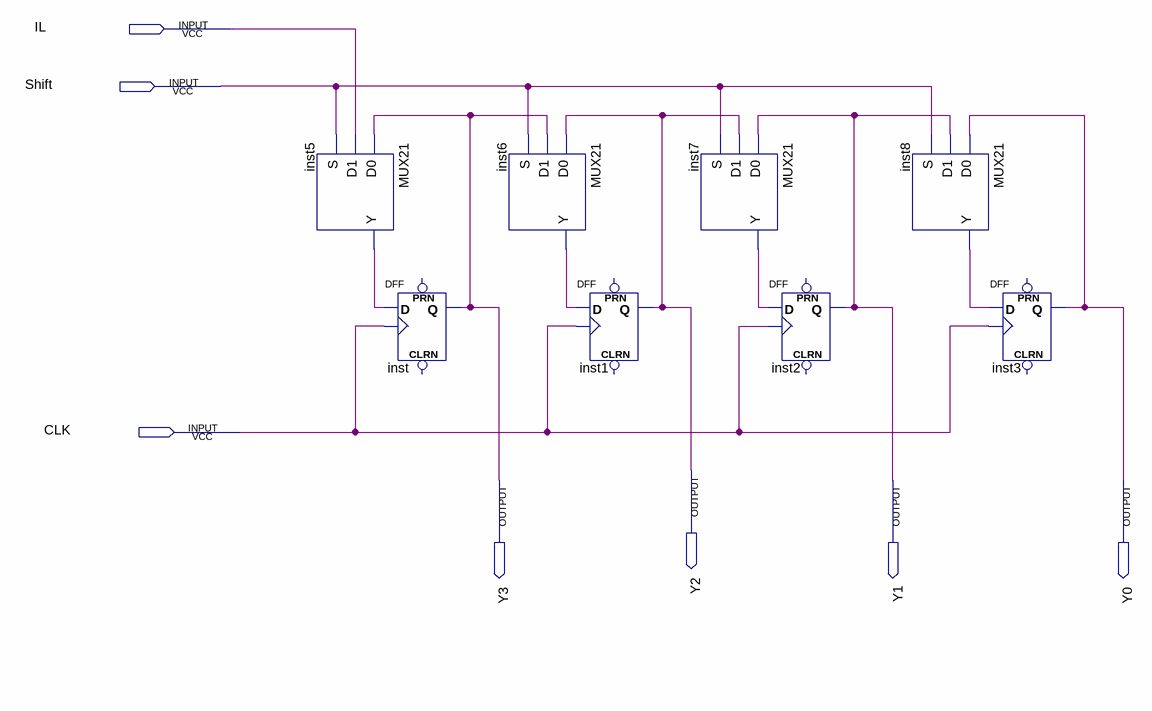
[diagram p0: schematic sheet]
// Quartus schematic Shilf_right.bdf as structural Verilog: 8 symbols, 7 pins
module Shilf_right (
  input  IL,
  input  Shift,
  input  CLK,
  output Y2,
  output Y3,
  output Y1,
  output Y0
);

  wire inst5_y, inst6_y, inst7_y, inst8_y;

  MUX21 inst5 (.D0(Y3), .D1(IL), .S(Shift), .Y(inst5_y));
  DFF inst (.CLK(CLK), .D(inst5_y), .Q(Y3));  // open: CLRN, PRN
  MUX21 inst6 (.D0(Y2), .D1(Y3), .S(Shift), .Y(inst6_y));
  DFF inst1 (.CLK(CLK), .D(inst6_y), .Q(Y2));  // open: CLRN, PRN
  MUX21 inst7 (.D0(Y1), .D1(Y2), .S(Shift), .Y(inst7_y));
  DFF inst2 (.CLK(CLK), .D(inst7_y), .Q(Y1));  // open: CLRN, PRN
  MUX21 inst8 (.D0(Y0), .D1(Y1), .S(Shift), .Y(inst8_y));
  DFF inst3 (.CLK(CLK), .D(inst8_y), .Q(Y0));  // open: CLRN, PRN
endmodule
